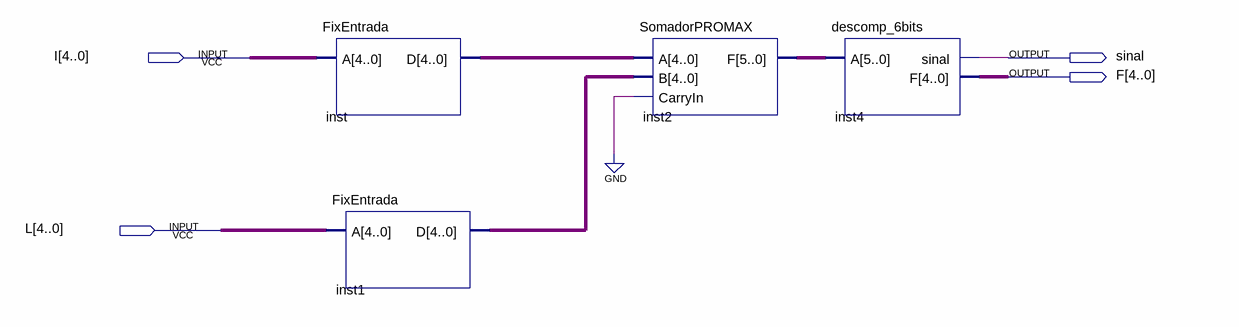
[diagram p0: schematic sheet]
// Quartus schematic SomadorDefinitivo.bdf as structural Verilog: 4 symbols, 4 pins
module SomadorDefinitivo (
  input  [4:0] I,
  input  [4:0] L,
  output sinal,
  output [4:0] F
);

  wire [4:0] inst1_d, inst_d;
  wire [5:0] inst2_f;

  FixEntrada inst (.A(I), .D(inst_d));
  FixEntrada inst1 (.A(L), .D(inst1_d));
  SomadorPROMAX inst2 (.A(inst_d), .B(inst1_d), .CarryIn(1'b0), .F(inst2_f));
  descomp_6bits inst4 (.A(inst2_f), .sinal(sinal), .F(F));
endmodule
